# Altium project Automated Component Testing PCB.PrjPcb (part 2 of 2)

## Sheet Temperature Sensors.SchDoc
size A; SheetNumber: 16; SheetTotal: 19
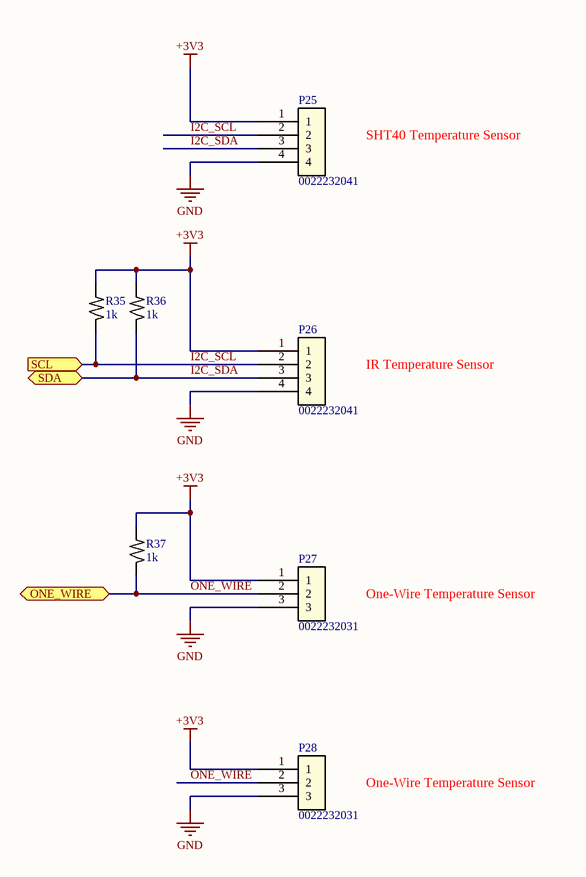
[diagram p16: Temperature Sensors.SchDoc]

### Parts
P25  0022232041  [Signal4]
P26  0022232041  [Signal4]
P27  0022232031  [Signal3]
P28  0022232031  [Signal3]
R35  1k  [R0603]
R36  1k  [R0603]
R37  1k  [R0603]

### Ports
ONE_WIRE (bidir), SCL (in), SDA (bidir)

### Nets
+3V3: P25.1 P26.1 P27.1 P28.1 R35.1 R36.1 R37.1
GND: P25.4 P26.4 P27.3 P28.3
I2C_SCL: P25.2 P26.2 R35.2 ; port SCL
I2C_SDA: P25.3 P26.3 R36.2 ; port SDA
ONE_WIRE: P27.2 P28.2 R37.2 ; port ONE_WIRE

### Notes on the sheet
- SHT40 Temperature Sensor
- IR Temperature Sensor
- One-Wire Temperature Sensor
- Project:
- Sheet Title:
- Size
- Date:
- A
- Sheet Number:
- Sheet Total:
- Revision:
- Time:
- Author:

### Library data of the parts
P25 P26 = Signal4: SignalConnector, 4 leads; MF: Molex; ComponentLink1Description: Datasheet; ComponentLink1URL: https://tools.molex.com/pdm_docs/ps/PS-10-07-001.pdf; ComponentLink2Description: Supplier1; ComponentLink2URL: https://www.digikey.com/en/products/detail/molex/0022232041/26671; MP: 0022232041
P27 P28 = Signal3: SignalConnector, 3 leads; MF: Molex; MP: 0022232031; ComponentLink1Description: Datasheet; ComponentLink1URL: https://tools.molex.com/pdm_docs/sd/022232031_sd.pdf; ComponentLink2Description: Supplier1; ComponentLink2URL: https://www.digikey.com/en/products/detail/molex/0022232031/26669
R35-R37 = Res: RES 1kΩ ±5% 100mW 0603; MF: VO; MP: SCR0603J1K; ComponentLink1Description: Datasheet; ComponentLink1URL: https://www.lcsc.com/datasheet/C3017736.pdf; ComponentLink2Description: Supplier1; ComponentLink2URL: https://www.lcsc.com/product-detail/C3017736.html

## Sheet Thermocouple to Digital Converter.SchDoc
size A; SheetNumber: 5; SheetTotal: 19
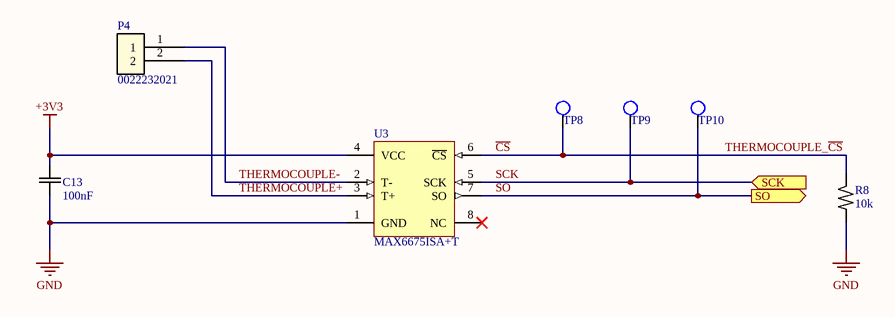
[diagram p17: Thermocouple to Digital Converter.SchDoc]

### Parts
C13  100nF  [C0603]
P4  0022232021  [Signal2]
R8  10k  [R0603]
TP8  TestPoint  [TESTPOINT_SMD_1.27MM]  (value not drawn)  (no BOM)
TP9  TestPoint  [TESTPOINT_SMD_1.27MM]  (value not drawn)  (no BOM)
TP10  TestPoint  [TESTPOINT_SMD_1.27MM]  (value not drawn)  (no BOM)
U3  MAX6675ISA+T  [SOIC-8]

### Ports
SCK (in), SO (out)

### Nets
+3V3: C13.2 U3.4(VCC)
GND: C13.1 R8.1 U3.1(GND)
~{CS}: R8.2 TP8.1 U3.6(~{CS})  [also labelled THERMOCOUPLE_~{CS}]
SCK: TP9.1 U3.5(SCK) ; port SCK
SO: TP10.1 U3.7(SO) ; port SO
THERMOCOUPLE+: P4.2 U3.3(T+)
THERMOCOUPLE-: P4.1 U3.2(T-)

Not connected (* = marked no-connect by the designer): U3 8(NC)*

### Notes on the sheet
- Project:
- Sheet Title:
- Size
- Date:
- A
- Sheet Number:
- Sheet Total:
- Revision:
- Time:
- Author:

### Library data of the parts
C13 = Cap_cer: CAP CER 100nF 50V X7R 0603; MF: HRE; MP: CGA0603X7R104K500JT; ComponentLink1Description: Datasheet; ComponentLink1URL: https://www.lcsc.com/datasheet/C6119867.pdf; ComponentLink2Description: Supplier1; ComponentLink2URL: https://www.lcsc.com/product-detail/C6119867.html
P4 = Signal2: SignalConnector, 2 leads; MF: Molex; ComponentLink1Description: Datasheet; ComponentLink1URL: https://www.molex.com/content/dam/molex/molex-dot-com/products/automated/en-us/salesdrawingpdf/637/6373/022232021_sd.pdf?inline; ComponentLink2Description: Supplier1; ComponentLink2URL: https://www.digikey.com/en/products/detail/molex/0022232021/26667; MP: 0022232021
R8 = Res: RES 10kΩ ±1% 100mW 0603; MF: FOJAN; MP: FRC0603F1002TS; ComponentLink1Description: Datasheet; ComponentLink1URL: https://www.lcsc.com/datasheet/C2906982.pdf; ComponentLink2Description: Supplier1; ComponentLink2URL: https://www.lcsc.com/product-detail/C2906982.html
U3 = MAX6675ISA+T: Cold-Junction-Compensated K-Thermocouple-to-Digital Converter; MF: MAXIM; ComponentLink1Description: Datasheet; ComponentLink1URL: https://www.lcsc.com/datasheet/C16030.pdf; ComponentLink2Description: Supplier1; ComponentLink2URL: https://www.lcsc.com/product-detail/C16030.html?s_z=n_MAX6675; MP: MAX6675ISA+T

## Sheet USB To UART Converter.SchDoc
size A; SheetNumber: 17; SheetTotal: 19
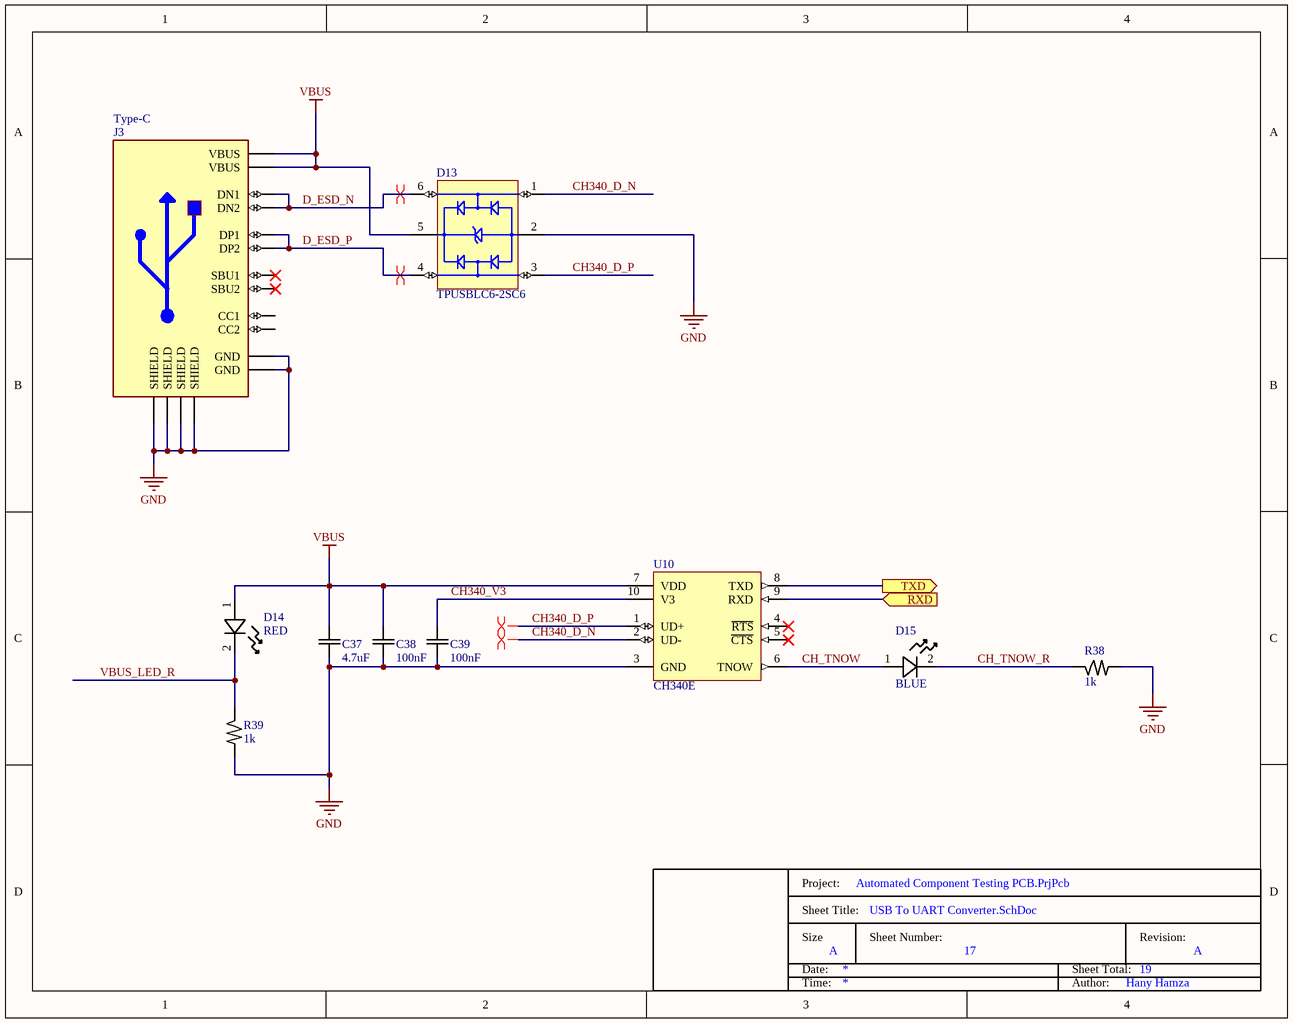
[diagram p18: USB To UART Converter.SchDoc]

### Parts
C37  4.7uF  [C0603]
C38  100nF  [C0603]
C39  100nF  [C0603]
D13  TPUSBLC6-2SC6  [SOT23-6]
D14  RED  [LED0805 RED]
D15  BLUE  [LED0805 BLUE]
J3  Type-C  [USB Type-C 16-Pin SMD]
R38  1k  [R0603]
R39  1k  [R0603]
U10  CH340E  [MSOP-10-NO EP]

### Ports
RXD (in), TXD (out)

### Nets
GND: C37.1 C38.1 C39.1 D13.2(GND) J3.A1_B12(GND) J3.B1_A12(GND) J3.S1(SHIELD) J3.S2(SHIELD) J3.S3(SHIELD) J3.S4(SHIELD) R38.1 R39.1 U10.3(GND)
VBUS: C37.2 C38.2 D13.5(VBUS) D14.1 J3.A4_B9(VBUS) J3.B4_A9(VBUS) U10.7(VDD)
CH340_D_N: D13.1(I/O1) U10.2(UD-)
CH340_D_P: D13.3(I/O2) U10.1(UD+)
CH340_V3: C39.2 U10.10(V3)
CH_TNOW: D15.1 U10.6(TNOW)
CH_TNOW_R: D15.2 R38.2
D_ESD_N: D13.6(I/O1) J3.A7(DN1) J3.B7(DN2)
D_ESD_P: D13.4(I/O2) J3.A6(DP1) J3.B6(DP2)
UART1_RX: U10.8(TXD) ; port TXD
UART1_TX: U10.9(RXD) ; port RXD
VBUS_LED_R: D14.2 R39.2

Not connected (* = marked no-connect by the designer): J3 A5(CC1) A8(SBU1)* B5(CC2) B8(SBU2)*; U10 4(~{RTS})* 5(~{CTS})*

### Layout directives
differential pair; net class USB: CH340_D_N, CH340_D_P, D_ESD_N, D_ESD_P

### Notes on the sheet
- Project:
- Sheet Title:
- Size
- Date:
- A
- Sheet Number:
- Sheet Total:
- Revision:
- Time:
- Author:

### Library data of the parts
C37 = Cap_cer: 10V 4.7uF X7R ±10% 0603 Ceramic Capacitors ROHS; MF: Chinocera; MP: HGC0603R7475K100NTHJ; ComponentLink1Description: Datasheet; ComponentLink1URL: *; ComponentLink2Description: Supplier1; ComponentLink2URL: https://www.lcsc.com/product-detail/C49333234.html?s_z=n_HGC0603R7475K100NTHJ
C38 C39 = Cap_cer: as C13 on sheet Thermocouple to Digital Converter; ComponentLink1Description: Datasheet; ComponentLink1URL: https://www.lcsc.com/datasheet/C6119867.pdf; ComponentLink2Description: Supplier1; ComponentLink2URL: https://www.lcsc.com/product-detail/C6119867.html
D13 = TPUSBLC6-2SC6: ESD DIODE 5VWM 15VC SOT-23-6; MF: TECH PUBLIC; ComponentLink1Description: Datasheet; ComponentLink1URL: https://www.lcsc.com/datasheet/C558442.pdf; ComponentLink2Description: Supplier1; ComponentLink2URL: https://www.lcsc.com/product-detail/C558442.html?s_z=n_C558442; MP: TPUSBLC6-2SC6
D14 = LED: LED RED WATER CLEAR 0805 SMD; MF: XINGLIGHT; MP: XL-TD2012SURC; ComponentLink1Description: Datasheet; ComponentLink1URL: https://www.lcsc.com/datasheet/C5349939.pdf; ComponentLink2Description: Supplier1; ComponentLink2URL: https://www.lcsc.com/product-detail/C5349939.html
D15 = LED: 20mA 500mcd~1200mcd 470nm Top-mount Blue 70mW 2.7V~3.2V 0805 LED Indication - Discrete RoHS; MF: XINGLIGHT; MP: XL-TD2012UBC; ComponentLink1Description: Datasheet; ComponentLink1URL: https://www.lcsc.com/datasheet/C5349940.pdf; ComponentLink2Description: Supplier1; ComponentLink2URL: https://www.lcsc.com/product-detail/C5349940.html
J3 = USB Type-C 16-Pin SMD: CONN RCPT Type-C 16POS SMD R/A; MF: DEALON; MP: USB-TYPE-C-019; ComponentLink1Description: Datasheet; ComponentLink1URL: https://www.lcsc.com/datasheet/C2927039.pdf; ComponentLink2Description: Supplier1; ComponentLink2URL: https://www.lcsc.com/product-detail/C2927039.html?s_z=n_C2927039
R38 R39 = Res: as R35 on sheet Temperature Sensors; ComponentLink1Description: Datasheet; ComponentLink1URL: https://www.lcsc.com/datasheet/C3017736.pdf; ComponentLink2Description: Supplier1; ComponentLink2URL: https://www.lcsc.com/product-detail/C3017736.html
U10 = CH340E: USB to Serial Port Chip CH340; MF: WCH; ComponentLink1Description: Datasheet; ComponentLink1URL: https://www.lcsc.com/datasheet/C99652.pdf; ComponentLink2Description: Supplier1; ComponentLink2URL: https://www.lcsc.com/product-detail/C99652.html?s_z=n_ch340; MP: CH340E

## Nets that join several sheets
+3V3: Main (P2.1 P3.1), 3.3V Buck Converter (7 pins), Control Interface (J4.2 R42.2 R43.2), Fan and Pump Headers (R20.2 R21.1), Parallel PCU Test (P23.1), RS-485 Transceiver (C40.2 R41.2 U11.8), Stepper Driver (R14.1 U6.15 U6.21), STM32F103C8T6 MCU (13 pins), Temperature Sensors (7 pins), Thermocouple to Digital Converter (C13.2 U3.4)
+5V0: 5V LDO (C17.1 D5.1 TP15.1 U5.3), Magnetometer and Electromagnet Driver (C14.2 U4.1), Sensors Test (P19.3)
+12V0: Main (P1.2), 3.3V Buck Converter (6 pins), 5V LDO (C15.2 C16.2 TP14.1 U5.1), CC Led Driver (C33.2 C34.2 U8.3), Fan and Pump Headers (8 pins), Magnetometer and Electromagnet Driver (D4.1 P5.1), Parallel LED Strip Buck Converter (C2.2 C3.2 TP1.1 U1.3), PTC Heater Driver (D6.1 K1.1), Sensors Test (6 pins), Stepper Driver (7 pins)
GND: Main (P1.1 P2.4 P3.4), 3.3V Buck Converter (10 pins), 5V LDO (7 pins), CC Led Driver (6 pins), Control Interface (6 pins), Fan and Pump Headers (U9.8), Magnetometer and Electromagnet Driver (5 pins), Parallel LED Strip Buck Converter (10 pins), Parallel PCU Test (P23.2 P24.1 R34.1), Power Supply Test (P21.1 P22.1 R29.1 R32.1), PTC Heater Driver (Q2.2 TP18.1), RS-485 Transceiver (C40.1 P29.3 U11.5), Sensors Test (9 pins), Stepper Driver (9 pins), STM32F103C8T6 MCU (14 pins), Temperature Sensors (P25.4 P26.4 P27.3 P28.3), Thermocouple to Digital Converter (C13.1 R8.1 U3.1), USB To UART Converter (13 pins)
+3V6_MON: Parallel PCU Test (R33.1 R34.2), STM32F103C8T6 MCU (U7.14)
+12V_MON: Power Supply Test (R28.1 R29.2), STM32F103C8T6 MCU (U7.10)
+24V_MON: Power Supply Test (R31.1 R32.2), STM32F103C8T6 MCU (U7.11)
DRV_DIR: Stepper Driver (TP22.1 U6.19), STM32F103C8T6 MCU (U7.33)
DRV_EN: Stepper Driver (TP20.1 U6.20), STM32F103C8T6 MCU (U7.38)
DRV_STP: Stepper Driver (TP21.1 U6.18), STM32F103C8T6 MCU (U7.32)
DRV_TOFF: Stepper Driver (TP23.1 U6.14), STM32F103C8T6 MCU (U7.18)
EM_FET: Magnetometer and Electromagnet Driver (R11.2), STM32F103C8T6 MCU (U7.15)
ENCODER_A: Control Interface (C41.2 R42.1 SW1.A), STM32F103C8T6 MCU (U7.19)
ENCODER_B: Control Interface (C42.2 R43.1 SW1.B), STM32F103C8T6 MCU (U7.20)
ENCODER_SW: Control Interface (SW1.D), STM32F103C8T6 MCU (U7.39)
I2C_SCL: Control Interface (J4.3), STM32F103C8T6 MCU (U7.45), Temperature Sensors (P25.2 P26.2 R35.2)
I2C_SDA: Control Interface (J4.4), STM32F103C8T6 MCU (U7.43), Temperature Sensors (P25.3 P26.3 R36.2)
MAG_OUT: Magnetometer and Electromagnet Driver (R9.1 R10.2), STM32F103C8T6 MCU (U7.17)
NetTP2_1: Parallel LED Strip Buck Converter (TP2.1 U1.5), STM32F103C8T6 MCU (U7.3)
NetTP29_1: CC Led Driver (TP29.1 U8.5), STM32F103C8T6 MCU (U7.4)
ONE_WIRE: STM32F103C8T6 MCU (U7.16), Temperature Sensors (P27.2 P28.2 R37.2)
OTHER_FANS: Fan and Pump Headers (U9.3 U9.4 U9.5 U9.6), STM32F103C8T6 MCU (U7.41)
PTC_FAN1_SPD: Fan and Pump Headers (P9.1 R20.1), STM32F103C8T6 MCU (U7.22)
PTC_FAN2_SPD: Fan and Pump Headers (P10.1 R21.2), STM32F103C8T6 MCU (U7.29)
PTC_FANS: Fan and Pump Headers (U9.1 U9.2), STM32F103C8T6 MCU (U7.40)
PUMP_CTRL: Fan and Pump Headers (U9.7), STM32F103C8T6 MCU (U7.42)
RELAY_FET: PTC Heater Driver (R13.2), STM32F103C8T6 MCU (U7.46)
RS_D: RS-485 Transceiver (U11.4), STM32F103C8T6 MCU (U7.12)
RS_R: RS-485 Transceiver (U11.1), STM32F103C8T6 MCU (U7.13)
SCK: STM32F103C8T6 MCU (U7.26), Thermocouple to Digital Converter (TP9.1 U3.5)
SO: STM32F103C8T6 MCU (U7.27), Thermocouple to Digital Converter (TP10.1 U3.7)
STM32_BOOT0: Main (P3.3), STM32F103C8T6 MCU (R16.1 TP26.1 U7.44)
STM32_NRST: Main (P3.2), STM32F103C8T6 MCU (R15.1 TP25.1 U7.7)
STM32_SWCLK: Main (P2.3), STM32F103C8T6 MCU (U7.37)
STM32_SWDIO: Main (P2.2), STM32F103C8T6 MCU (U7.34)
UART1_RX: STM32F103C8T6 MCU (U7.31), USB To UART Converter (U10.8)
UART1_TX: STM32F103C8T6 MCU (U7.30), USB To UART Converter (U10.9)